# Altium schematic sheet PWR_REG.SchDoc
size A4; DocumentNumber: 1; SheetNumber: 5; SheetTotal: 6
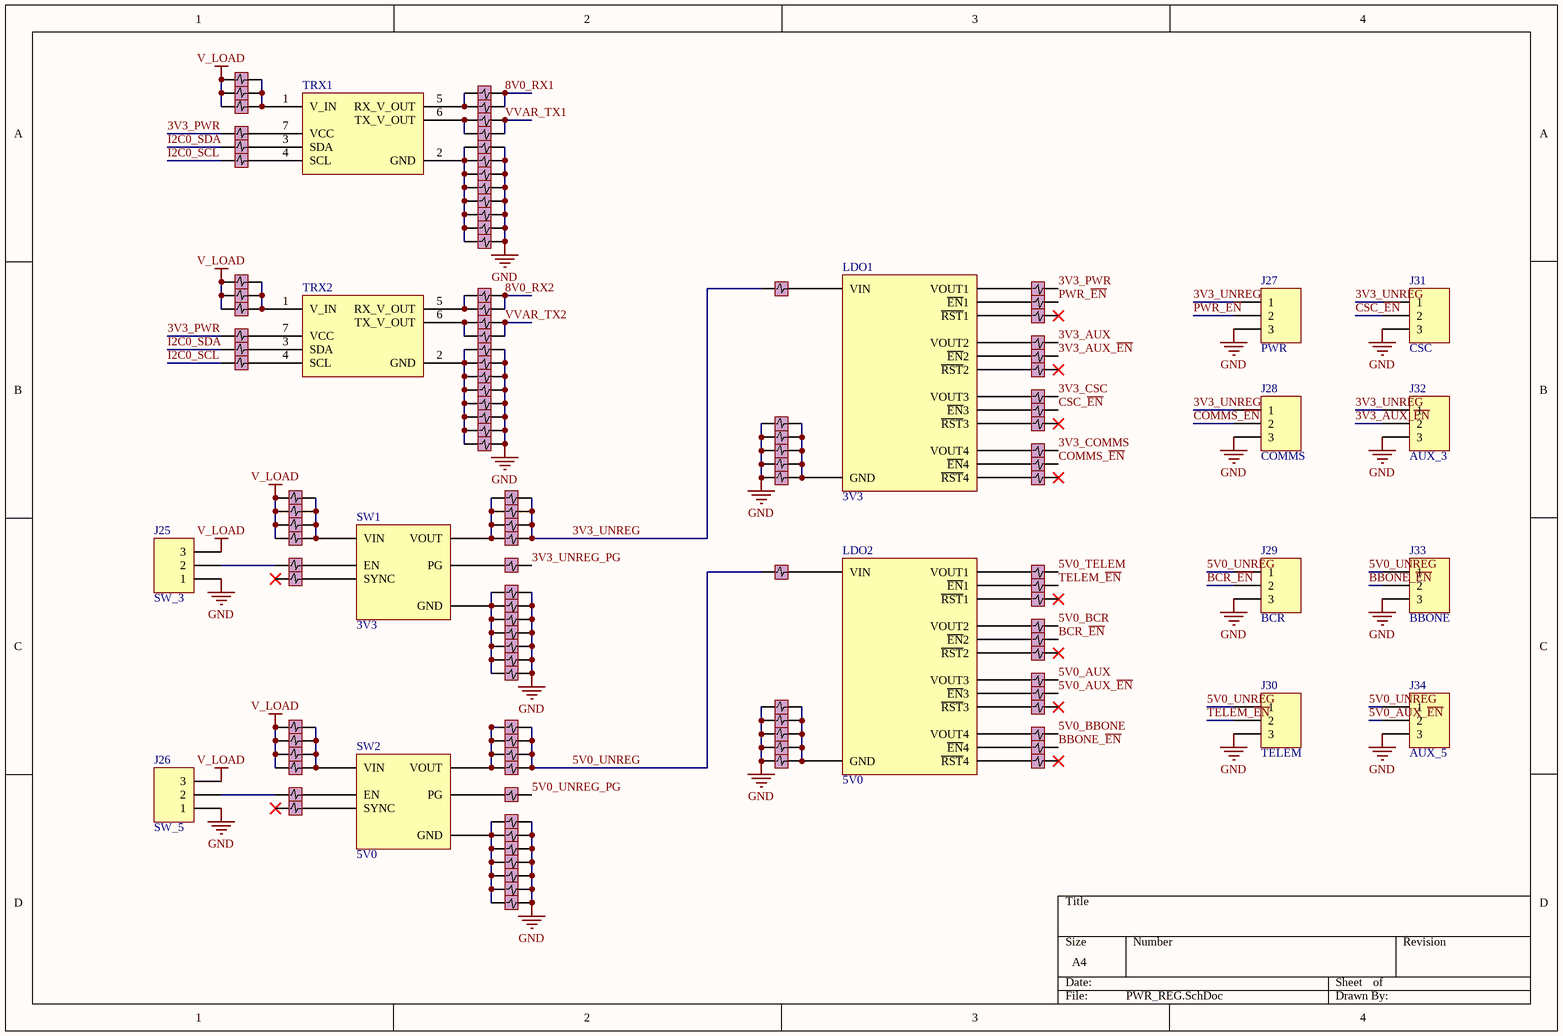
[diagram p0: PWR_REG.SchDoc]

## Parts
J25  SW_3  [HDR1X3]
J26  SW_5  [HDR1X3]
J27  PWR  [HDR1X3]
J28  COMMS  [HDR1X3]
J29  BCR  [HDR1X3]
J30  TELEM  [HDR1X3]
J31  CSC  [HDR1X3]
J32  AUX_3  [HDR1X3]
J33  BBONE  [HDR1X3]
J34  AUX_5  [HDR1X3]
LDO1  3V3  [LDO]
LDO2  5V0  [LDO]
P433  Jumper_Filter  [Jumper_filter]  (value not drawn)
P434  Jumper_Filter  [Jumper_filter]  (value not drawn)
P435  Jumper_Filter  [Jumper_filter]  (value not drawn)
P436  Jumper_Filter  [Jumper_filter]  (value not drawn)
P437  Jumper_Filter  [Jumper_filter]  (value not drawn)
P438  Jumper_Filter  [Jumper_filter]  (value not drawn)
P439  Jumper_Filter  [Jumper_filter]  (value not drawn)
P440  Jumper_Filter  [Jumper_filter]  (value not drawn)
P441  Jumper_Filter  [Jumper_filter]  (value not drawn)
P442  Jumper_Filter  [Jumper_filter]  (value not drawn)
P443  Jumper_Filter  [Jumper_filter]  (value not drawn)
P444  Jumper_Filter  [Jumper_filter]  (value not drawn)
P445  Jumper_Filter  [Jumper_filter]  (value not drawn)
P446  Jumper_Filter  [Jumper_filter]  (value not drawn)
P447  Jumper_Filter  [Jumper_filter]  (value not drawn)
P448  Jumper_Filter  [Jumper_filter]  (value not drawn)
P449  Jumper_Filter  [Jumper_filter]  (value not drawn)
P450  Jumper_Filter  [Jumper_filter]  (value not drawn)
P451  Jumper_Filter  [Jumper_filter]  (value not drawn)
P452  Jumper_Filter  [Jumper_filter]  (value not drawn)
P453  Jumper_Filter  [Jumper_filter]  (value not drawn)
P454  Jumper_Filter  [Jumper_filter]  (value not drawn)
P455  Jumper_Filter  [Jumper_filter]  (value not drawn)
P456  Jumper_Filter  [Jumper_filter]  (value not drawn)
P457  Jumper_Filter  [Jumper_filter]  (value not drawn)
P458  Jumper_Filter  [Jumper_filter]  (value not drawn)
P459  Jumper_Filter  [Jumper_filter]  (value not drawn)
P460  Jumper_Filter  [Jumper_filter]  (value not drawn)
P461  Jumper_Filter  [Jumper_filter]  (value not drawn)
P462  Jumper_Filter  [Jumper_filter]  (value not drawn)
P463  Jumper_Filter  [Jumper_filter]  (value not drawn)
P464  Jumper_Filter  [Jumper_filter]  (value not drawn)
P465  Jumper_Filter  [Jumper_filter]  (value not drawn)
P466  Jumper_Filter  [Jumper_filter]  (value not drawn)
P467  Jumper_Filter  [Jumper_filter]  (value not drawn)
P468  Jumper_Filter  [Jumper_filter]  (value not drawn)
P469  Jumper_Filter  [Jumper_filter]  (value not drawn)
P470  Jumper_Filter  [Jumper_filter]  (value not drawn)
P471  Jumper_Filter  [Jumper_filter]  (value not drawn)
P472  Jumper_Filter  [Jumper_filter]  (value not drawn)
P473  Jumper_Filter  [Jumper_filter]  (value not drawn)
P474  Jumper_Filter  [Jumper_filter]  (value not drawn)
P475  Jumper_Filter  [Jumper_filter]  (value not drawn)
P476  Jumper_Filter  [Jumper_filter]  (value not drawn)
P477  Jumper_Filter  [Jumper_filter]  (value not drawn)
P478  Jumper_Filter  [Jumper_filter]  (value not drawn)
P479  Jumper_Filter  [Jumper_filter]  (value not drawn)
P480  Jumper_Filter  [Jumper_filter]  (value not drawn)
P481  Jumper_Filter  [Jumper_filter]  (value not drawn)
P482  Jumper_Filter  [Jumper_filter]  (value not drawn)
P483  Jumper_Filter  [Jumper_filter]  (value not drawn)
P484  Jumper_Filter  [Jumper_filter]  (value not drawn)
P485  Jumper_Filter  [Jumper_filter]  (value not drawn)
P486  Jumper_Filter  [Jumper_filter]  (value not drawn)
P487  Jumper_Filter  [Jumper_filter]  (value not drawn)
P488  Jumper_Filter  [Jumper_filter]  (value not drawn)
P489  Jumper_Filter  [Jumper_filter]  (value not drawn)
P490  Jumper_Filter  [Jumper_filter]  (value not drawn)
P491  Jumper_Filter  [Jumper_filter]  (value not drawn)
P492  Jumper_Filter  [Jumper_filter]  (value not drawn)
P493  Jumper_Filter  [Jumper_filter]  (value not drawn)
P494  Jumper_Filter  [Jumper_filter]  (value not drawn)
P495  Jumper_Filter  [Jumper_filter]  (value not drawn)
P496  Jumper_Filter  [Jumper_filter]  (value not drawn)
P497  Jumper_Filter  [Jumper_filter]  (value not drawn)
P498  Jumper_Filter  [Jumper_filter]  (value not drawn)
P499  Jumper_Filter  [Jumper_filter]  (value not drawn)
P500  Jumper_Filter  [Jumper_filter]  (value not drawn)
P501  Jumper_Filter  [Jumper_filter]  (value not drawn)
P502  Jumper_Filter  [Jumper_filter]  (value not drawn)
P503  Jumper_Filter  [Jumper_filter]  (value not drawn)
P504  Jumper_Filter  [Jumper_filter]  (value not drawn)
P505  Jumper_Filter  [Jumper_filter]  (value not drawn)
P506  Jumper_Filter  [Jumper_filter]  (value not drawn)
P507  Jumper_Filter  [Jumper_filter]  (value not drawn)
P508  Jumper_Filter  [Jumper_filter]  (value not drawn)
P509  Jumper_Filter  [Jumper_filter]  (value not drawn)
P510  Jumper_Filter  [Jumper_filter]  (value not drawn)
P511  Jumper_Filter  [Jumper_filter]  (value not drawn)
P512  Jumper_Filter  [Jumper_filter]  (value not drawn)
P513  Jumper_Filter  [Jumper_filter]  (value not drawn)
P514  Jumper_Filter  [Jumper_filter]  (value not drawn)
P515  Jumper_Filter  [Jumper_filter]  (value not drawn)
P516  Jumper_Filter  [Jumper_filter]  (value not drawn)
P517  Jumper_Filter  [Jumper_filter]  (value not drawn)
P518  Jumper_Filter  [Jumper_filter]  (value not drawn)
P519  Jumper_Filter  [Jumper_filter]  (value not drawn)
P520  Jumper_Filter  [Jumper_filter]  (value not drawn)
P521  Jumper_Filter  [Jumper_filter]  (value not drawn)
P522  Jumper_Filter  [Jumper_filter]  (value not drawn)
P523  Jumper_Filter  [Jumper_filter]  (value not drawn)
P524  Jumper_Filter  [Jumper_filter]  (value not drawn)
P525  Jumper_Filter  [Jumper_filter]  (value not drawn)
P526  Jumper_Filter  [Jumper_filter]  (value not drawn)
P527  Jumper_Filter  [Jumper_filter]  (value not drawn)
P528  Jumper_Filter  [Jumper_filter]  (value not drawn)
P529  Jumper_Filter  [Jumper_filter]  (value not drawn)
P530  Jumper_Filter  [Jumper_filter]  (value not drawn)
P531  Jumper_Filter  [Jumper_filter]  (value not drawn)
P532  Jumper_Filter  [Jumper_filter]  (value not drawn)
P533  Jumper_Filter  [Jumper_filter]  (value not drawn)
P534  Jumper_Filter  [Jumper_filter]  (value not drawn)
P535  Jumper_Filter  [Jumper_filter]  (value not drawn)
P536  Jumper_Filter  [Jumper_filter]  (value not drawn)
P537  Jumper_Filter  [Jumper_filter]  (value not drawn)
P538  Jumper_Filter  [Jumper_filter]  (value not drawn)
P539  Jumper_Filter  [Jumper_filter]  (value not drawn)
P540  Jumper_Filter  [Jumper_filter]  (value not drawn)
SW1  3V3  [LVSwitcher]
SW2  5V0  [LVSwitcher]
TRX1  TRX_REGULATOR  [TRX_REGULATOR]  (value not drawn)
TRX2  TRX_REGULATOR  [TRX_REGULATOR]  (value not drawn)

## Nets
GND: J25.1 J26.1 J27.3 J28.3 J29.3 J30.3 J31.3 J32.3 J33.3 J34.3 P433.3 P434.3 P435.3 P436.3 P437.3 P438.3 P439.3 P440.3 P441.3 P442.3 P443.3 P444.3 P445.3 P446.3 P447.3 P448.3 P449.3 P450.3 P451.3 P452.3 P453.3 P454.3 P455.3 P456.3 P457.3 P458.3 P459.3 P460.3 P461.1 P461.3 P462.1 P462.3 P463.1 P463.3 P464.1 P464.3 P465.1 P465.3 P466.1 P466.3 P467.1 P467.3 P468.1 P468.3 P469.3 P470.3 P471.3 P472.3 P473.1 P473.3 P474.1 P474.3 P475.1 P475.3 P476.1 P476.3 P477.1 P477.3 P478.1 P478.3 P479.1 P479.3 P480.1 P480.3 P481.3 P482.3 P483.3 P484.3 P485.3 P486.1 P486.3 P487.1 P487.3 P488.1 P488.3 P489.1 P489.3 P490.1 P490.3 P491.1 P491.3 P492.1 P492.3 P493.3 P494.3 P495.3 P496.3 P497.3 P498.1 P498.3 P499.1 P499.3 P500.1 P500.3 P501.1 P501.3 P502.1 P502.3 P503.1 P503.3 P504.1 P504.3 P505.3 P506.1 P506.3 P507.1 P507.3 P508.1 P508.3 P509.1 P509.3 P510.1 P510.3 P511.3 P512.1 P512.3 P513.1 P513.3 P514.1 P514.3 P515.1 P515.3 P516.1 P516.3 P517.3 P518.3 P519.3 P520.3 P521.3 P522.3 P523.3 P524.3 P525.3 P526.3 P527.3 P528.3 P529.3 P530.3 P531.3 P532.3 P533.3 P534.3 P535.3 P536.3 P537.3 P538.3 P539.3 P540.3
V_LOAD: J25.3 J26.3 P433.1 P434.1 P435.1 P439.1 P440.1 P441.1 P445.1 P446.1 P447.1 P448.1 P451.1 P452.1 P453.1 P454.1
3V3_AUX: P520.1
3V3_AUX_~{EN}: J32.2 P521.1
3V3_COMMS: P526.1
3V3_CSC: P523.1
3V3_PWR: P436.1 P442.1 P517.1
3V3_UNREG: J27.1 J28.1 J31.1 J32.1 P481.1 P482.1 P483.1 P484.1 P505.1
3V3_UNREG_PG: P485.1
5V0_AUX: P535.1
5V0_AUX_~{EN}: J34.2 P536.1
5V0_BBONE: P538.1
5V0_BCR: P532.1
5V0_TELEM: P529.1
5V0_UNREG: J29.1 J30.1 J33.1 J34.1 P493.1 P494.1 P495.1 P496.1 P511.1
5V0_UNREG_PG: P497.1
8V0_RX1: P457.1 P458.1
8V0_RX2: P469.1 P470.1
BBONE_~{EN}: J33.2 P539.1
BCR_~{EN}: J29.2 P533.1
COMMS_~{EN}: J28.2 P527.1
CSC_~{EN}: J31.2 P524.1
I2C0_SCL: P438.1 P444.1
I2C0_SDA: P437.1 P443.1
PWR_~{EN}: J27.2 P518.1
TELEM_~{EN}: J30.2 P530.1
VVAR_TX1: P459.1 P460.1
VVAR_TX2: P471.1 P472.1
NetJ25_2: J25.2 P449.1
NetJ26_2: J26.2 P455.1
NetLDO1_EN1: LDO1.EN1(~{EN}1) P518.2
NetLDO1_EN2: LDO1.EN2(~{EN}2) P521.2
NetLDO1_EN3: LDO1.EN3(~{EN}3) P524.2
NetLDO1_EN4: LDO1.EN4(~{EN}4) P527.2
NetLDO1_GND: LDO1.GND P506.2 P507.2 P508.2 P509.2 P510.2
NetLDO1_RST1: LDO1.RST1(~{RST}1) P519.2
NetLDO1_RST2: LDO1.RST2(~{RST}2) P522.2
NetLDO1_RST3: LDO1.RST3(~{RST}3) P525.2
NetLDO1_RST4: LDO1.RST4(~{RST}4) P528.2
NetLDO1_VIN: LDO1.VIN P505.2
NetLDO1_VOUT1: LDO1.VOUT1 P517.2
NetLDO1_VOUT2: LDO1.VOUT2 P520.2
NetLDO1_VOUT3: LDO1.VOUT3 P523.2
NetLDO1_VOUT4: LDO1.VOUT4 P526.2
NetLDO2_EN1: LDO2.EN1(~{EN}1) P530.2
NetLDO2_EN2: LDO2.EN2(~{EN}2) P533.2
NetLDO2_EN3: LDO2.EN3(~{EN}3) P536.2
NetLDO2_EN4: LDO2.EN4(~{EN}4) P539.2
NetLDO2_GND: LDO2.GND P512.2 P513.2 P514.2 P515.2 P516.2
NetLDO2_RST1: LDO2.RST1(~{RST}1) P531.2
NetLDO2_RST2: LDO2.RST2(~{RST}2) P534.2
NetLDO2_RST3: LDO2.RST3(~{RST}3) P537.2
NetLDO2_RST4: LDO2.RST4(~{RST}4) P540.2
NetLDO2_VIN: LDO2.VIN P511.2
NetLDO2_VOUT1: LDO2.VOUT1 P529.2
NetLDO2_VOUT2: LDO2.VOUT2 P532.2
NetLDO2_VOUT3: LDO2.VOUT3 P535.2
NetLDO2_VOUT4: LDO2.VOUT4 P538.2
NetP433_2: P433.2 P434.2 P435.2 TRX1.1(V_IN)
NetP436_2: P436.2 TRX1.7(VCC)
NetP437_2: P437.2 TRX1.3(SDA)
NetP438_2: P438.2 TRX1.4(SCL)
NetP439_2: P439.2 P440.2 P441.2 TRX2.1(V_IN)
NetP442_2: P442.2 TRX2.7(VCC)
NetP443_2: P443.2 TRX2.3(SDA)
NetP444_2: P444.2 TRX2.4(SCL)
NetP445_2: P445.2 P446.2 P447.2 P448.2 SW1.Vin(VIN)
NetP449_2: P449.2 SW1.EN
NetP450_2: P450.2 SW1.SYNC
NetP451_2: P451.2 P452.2 P453.2 P454.2 SW2.Vin(VIN)
NetP455_2: P455.2 SW2.EN
NetP456_2: P456.2 SW2.SYNC
NetP457_2: P457.2 P458.2 TRX1.5(RX_V_OUT)
NetP459_2: P459.2 P460.2 TRX1.6(TX_V_OUT)
NetP461_2: P461.2 P462.2 P463.2 P464.2 P465.2 P466.2 P467.2 P468.2 TRX1.2(GND)
NetP469_2: P469.2 P470.2 TRX2.5(RX_V_OUT)
NetP471_2: P471.2 P472.2 TRX2.6(TX_V_OUT)
NetP473_2: P473.2 P474.2 P475.2 P476.2 P477.2 P478.2 P479.2 P480.2 TRX2.2(GND)
NetP481_2: P481.2 P482.2 P483.2 P484.2 SW1.Vout(VOUT)
NetP485_2: P485.2 SW1.PG
NetP486_2: P486.2 P487.2 P488.2 P489.2 P490.2 P491.2 P492.2 SW1.GND
NetP493_2: P493.2 P494.2 P495.2 P496.2 SW2.Vout(VOUT)
NetP497_2: P497.2 SW2.PG
NetP498_2: P498.2 P499.2 P500.2 P501.2 P502.2 P503.2 P504.2 SW2.GND

Not connected (* = marked no-connect by the designer): P450 1*; P456 1*; P519 1*; P522 1*; P525 1*; P528 1*; P531 1*; P534 1*; P537 1*; P540 1*

## Library data of the parts
J25-J34 = Header 3: Header, 3-Pin; LatestRevisionNote: Re-released for DXP Platform.; Publisher: Altium Limited
  J25: ClassName: SW1
  J26: LatestRevisionDate: 17-Jul-2002; ClassName: SW2
  J27 J28 J31 J32: LatestRevisionDate: 17-Jul-2002; ClassName: LDO1
  J29 J30 J33 J34: LatestRevisionDate: 17-Jul-2002; ClassName: LDO2
LDO1 LDO2 = LDO
  LDO1: ClassName: LDO1
  LDO2: ClassName: LDO2
SW1 SW2 = LVSWITCHER
  SW1: ClassName: SW1
  SW2: ClassName: SW2
P433-P540 = Jumper_Filter
  P433-P438 P457-P468: ClassName: TRX1
  P439-P444 P469-P480: ClassName: TRX2
  P445-P450 P481-P492: ClassName: SW1
  P451-P456 P493-P504: ClassName: SW2
  P505-P510 P517-P528: ClassName: LDO1
  P511-P516 P529-P540: ClassName: LDO2
TRX1 TRX2 = TRX_REGULATOR
  TRX1: ClassName: TRX1
  TRX2: ClassName: TRX2